# EAGLE design DC DC Converter Eagle (EAGLE 9.6.2)
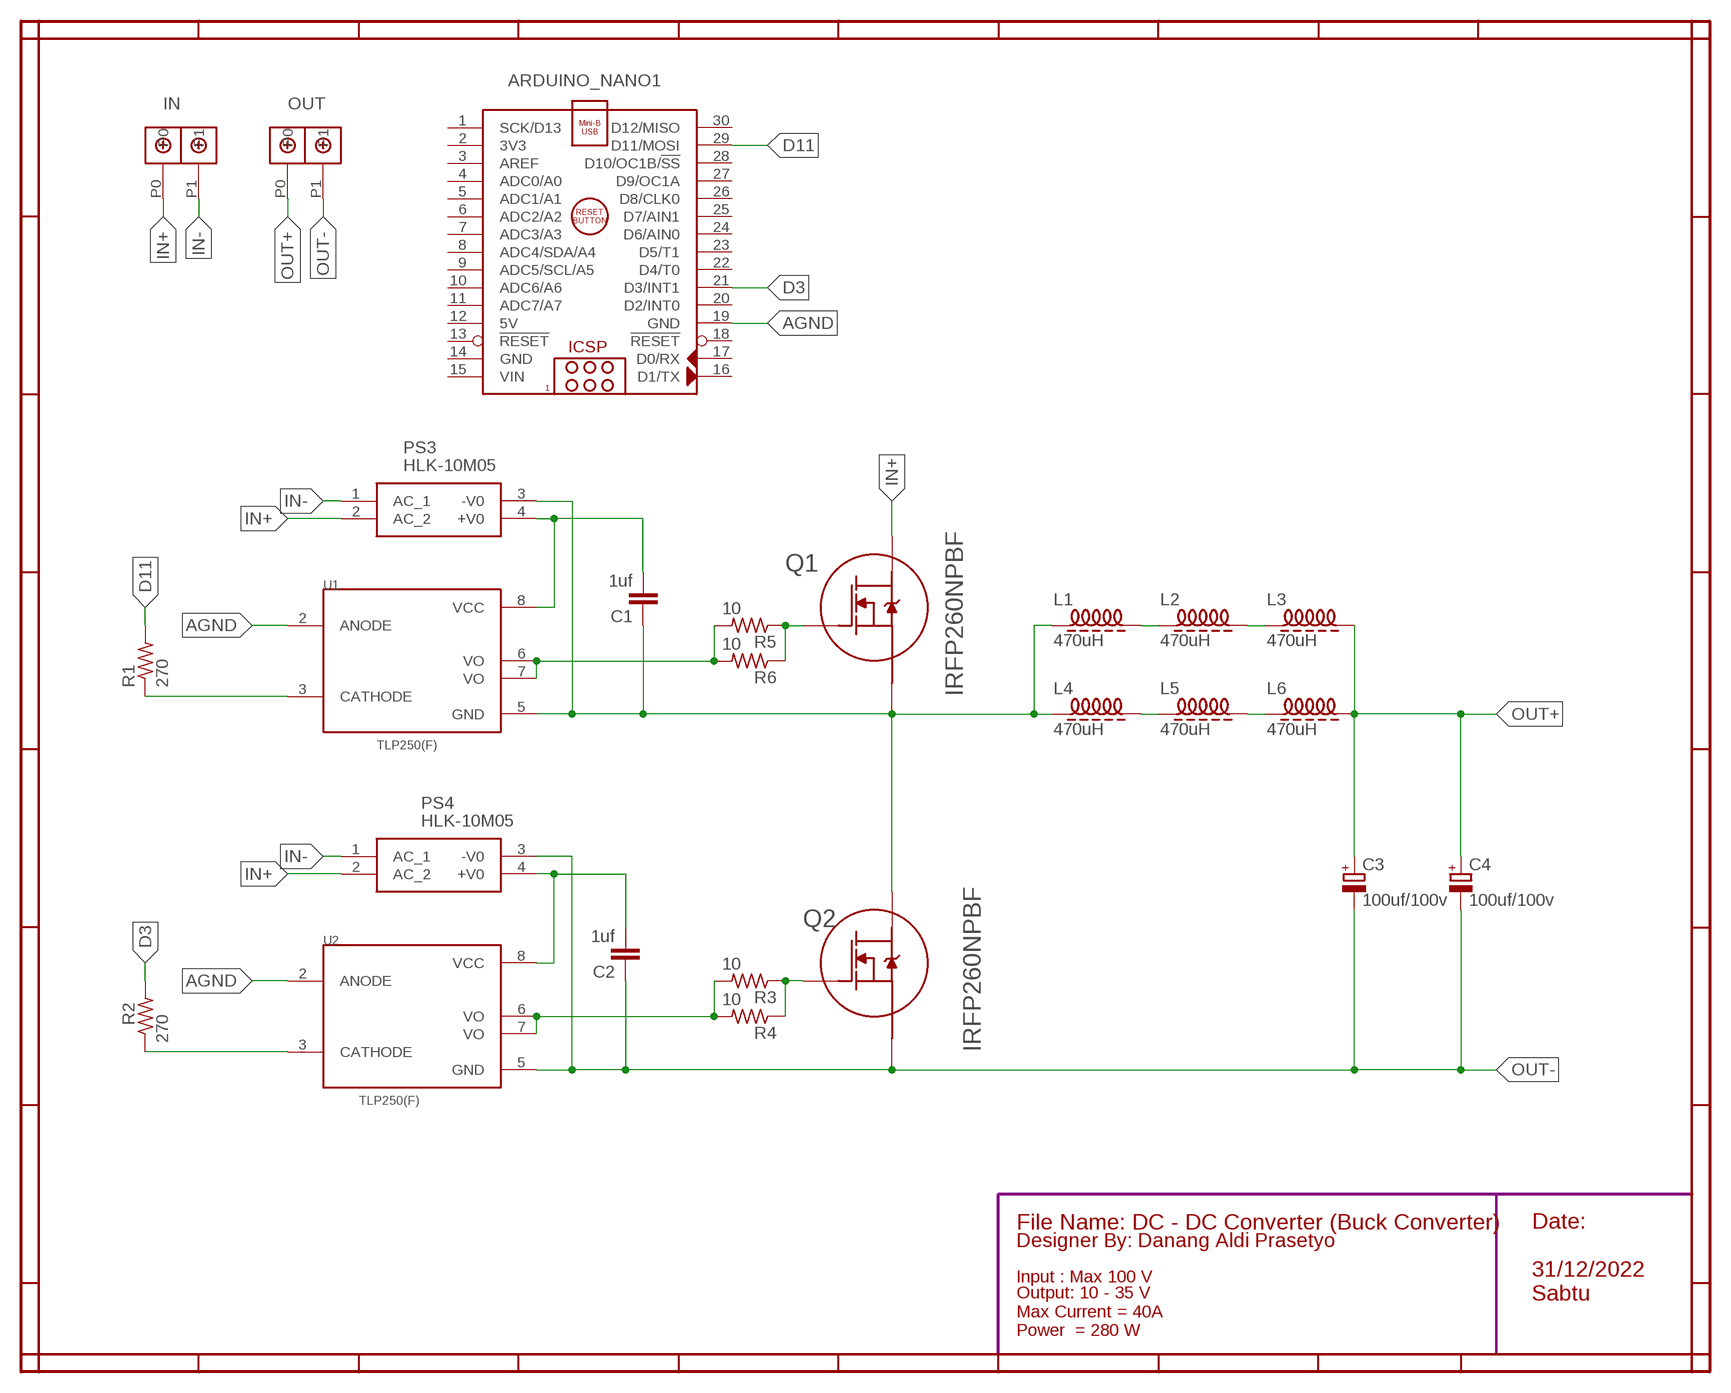
[diagram p0: schematic, sheet 1]

## Parts
ARDUINO_NANO1  ARDUINO_NANO  [ARDUINO_NANO]
C1  1uf  C-EU025-024X044  [C025-024X044]
C2  1uf  C-EU025-024X044  [C025-024X044]
C3  100uf/100v  CPOL-EUE5-10.5  [E5-10,5]
C4  100uf/100v  CPOL-EUE5-10.5  [E5-10,5]
L1  470uH  Z15/15CCW  [Z15/15]
L2  470uH  Z15/15CCW  [Z15/15]
L3  470uH  Z15/15CCW  [Z15/15]
L4  470uH  Z15/15CCW  [Z15/15]
L5  470uH  Z15/15CCW  [Z15/15]
L6  470uH  Z15/15CCW  [Z15/15]
PS3  HLK-10M05  [HLK10M05]
PS4  HLK-10M05  [HLK10M05]
Q1  IRFP260NPBF  [TO545P1590X530X2460-3]
Q2  IRFP260NPBF  [TO545P1590X530X2460-3]
R1  270  R-US_0207/7  [0207/7]
R2  270  R-US_0207/7  [0207/7]
R3  10  R-US_0207/7  [0207/7]
R4  10  R-US_0207/7  [0207/7]
R5  10  R-US_0207/7  [0207/7]
R6  10  R-US_0207/7  [0207/7]
U1  TLP250(F)  [DIP1016W50P254L966H380Q8P]
U2  TLP250(F)  [DIP1016W50P254L966H380Q8P]
U$1  DBCONN-1X2  [DBCONN-1X2]
U$2  DBCONN-1X2  [DBCONN-1X2]

## Nets
AGND: ARDUINO_NANO1.19(GND) U1.2(ANODE) U2.2(ANODE)
D3: ARDUINO_NANO1.21(D3/INT1) R2.2
D11: ARDUINO_NANO1.29(D11/MOSI) R1.2
IN+: PS3.2(AC_2) PS4.2(AC_2) Q1.2(D) U$1.P0
IN-: PS3.1(AC_1) PS4.1(AC_1) U$1.P1
N$1: C1.2 PS3.4(+V0) U1.8(VCC)
N$2: C1.1 L1.1 L4.1 PS3.3(-V0) Q1.3(S) Q2.2(D) U1.5(GND)
N$3: R1.1 U1.3(CATHODE)
N$4: Q1.1(G) R5.1 R6.1
N$6: R5.2 R6.2 U1.6(VO) U1.7(VO)
N$10: R2.1 U2.3(CATHODE)
N$12: C2.2 PS4.4(+V0) U2.8(VCC)
N$14: R3.2 R4.2 U2.6(VO) U2.7(VO)
N$15: Q2.1(G) R3.1 R4.1
N$16: L1.2 L2.1
N$17: L2.2 L3.1
N$18: L4.2 L5.1
N$19: L5.2 L6.1
OUT+: C3.+ C4.+ L3.2 L6.2 U$2.P0
OUT-: C2.1 C3.- C4.- PS4.3(-V0) Q2.3(S) U2.5(GND) U$2.P1
Unconnected: ARDUINO_NANO1.1(SCK/D13) ARDUINO_NANO1.2(3V3) ARDUINO_NANO1.3(AREF) ARDUINO_NANO1.4(ADC0/A0) ARDUINO_NANO1.5(ADC1/A1) ARDUINO_NANO1.6(ADC2/A2) ARDUINO_NANO1.7(ADC3/A3) ARDUINO_NANO1.8(ADC4/SDA/A4) ARDUINO_NANO1.9(ADC5/SCL/A5) ARDUINO_NANO1.10(ADC6/A6) ARDUINO_NANO1.11(ADC7/A7) ARDUINO_NANO1.13(!RESET) ARDUINO_NANO1.16(D1/TX) ARDUINO_NANO1.17(D0/RX) ARDUINO_NANO1.18(!RESET) ARDUINO_NANO1.20(D2/INT0) ARDUINO_NANO1.22(D4/T0) ARDUINO_NANO1.23(D5/T1) ARDUINO_NANO1.24(D6/AIN0) ARDUINO_NANO1.25(D7/AIN1) ARDUINO_NANO1.26(D8/CLK0) ARDUINO_NANO1.27(D9/OC1A) ARDUINO_NANO1.28(D10/OC1B/!SS) ARDUINO_NANO1.30(D12/MISO)

## Notes on the sheet
- IN | OUT
- File Name: DC - DC Converter (Buck Converter)
- Designer By: Danang Aldi Prasetyo
- Input : Max 100 V
- Date:
  
  31/12/2022
  Sabtu
- Output: 10 - 35 V
  Max Current = 40A
  Power  = 280 W

## Power pins joined to a net without a drawn wire
5V: ARDUINO_NANO1.12(5V)
GND: ARDUINO_NANO1.14(GND)
VIN: ARDUINO_NANO1.15(VIN)

## Library data of the parts
ARDUINO_NANO1 = ArduinoNanoV30:ARDUINO_NANO: Arduino Nano V3.0 Module Overview: The Arduino Nano is a small, complete, and breadboard-friendly board based on the ATmega328 (Arduino Nano 3.x) or ATmega168 (Arduino Nano 2.x). It has more or less the same functionality of the Arduino Duemilanove, but in a different package. It lacks only a DC power jack, and works with a Mini-B USB cable instead of a standard one. The Nano was designed and is being produced by Gravitech <http://www.gravitech.us/arna30wiatp.html>. General specifications: Item Value Microcontroller Atmel ATmega168 or ATmega328 Operating Voltage (logic level) 5 V Input Voltage (recommended) 7-12 V Input Voltage (limits) 6-20 V Digital I/O Pins 14 (of which 6 provide PWM output) Analog Input Pins 8 DC Current per I/O Pin 40 mA Flash Memory 16 KB (ATmega168) or 32 KB (ATmega328) of which 2 KB used by bootloader SRAM 1 KB (ATmega168) or 2 KB (ATmega328) EEPROM 512 bytes (ATmega168) or 1 KB (ATmega328) Clock Speed 16 MHz Dimensions (Inches) 0.73" x 1.70" Dimensions (mm) 18mm x 45mm Overall height About 9 mm (not including pins) Weigth 5 g Power: The Arduino Nano can be powered via the Mini-B USB connection, 6-20V unregulated external power supply (pin 30), or 5V regulated external power supply (pin 27). The power source is automatically selected to the highest voltage source. Memory: The ATmega168 has 16 KB of flash memory for storing code (of which 2 KB is used for the bootloader); the ATmega328 has 32 KB, (also with 2 KB used for the bootloader). The ATmega168 has 1 KB of SRAM and 512 bytes of EEPROM (which can be read and written with the EEPROM library); the ATmega328 has 2 KB of SRAM and 1 KB of EEPROM. Input and Output: Each of the 14 digital pins on the Nano can be used as an input or output, using pinMode(), digitalWrite(), and digitalRead() functions. They operate at 5 volts. Each pin can provide or receive a maximum of 40 mA and has an internal pull-up resistor (disconnected by default) of 20-50 kOhms. In addition, some pins have specialized functions. Visit Arduino - ArduinoBoardNano <https://www.arduino.cc/en/Main/ArduinoBoardNano>
C1 C2 = rcl:C-EU: CAPACITOR, European symbol; SPICEPREFIX: C
C3 C4 = rcl:CPOL-EU: POLARIZED CAPACITOR, European symbol; SPICEPREFIX: C
L1-L6 = inductor-neosid:Z?CCW: CHOKE free-suspension choke/nominal inductance winding counter clockwise; OC_FARNELL: unknown; OC_NEWARK: unknown
PS3 PS4 = HLK-10M05:HLK-10M05: HI-LINK HLK-10M05 Manufacturer : HI-LINK <https://lcsc.com//brand-detail/11515.html> Mfr.Part # HLK-10M05 LCSC Part # C403745 <https://lcsc.com/product-detail/show_C403745.html> Package : Through Hole Datasheet :  EasyEDA Model <javascript:void(0);> Power Module AC-DC Through Hole RoHS Source: Datasheet <https://datasheet.lcsc.com/szlcsc/1909111105_HI-LINK-HLK-10M05_C403745.pdf> Check availability <https://pricing.snapeda.com/parts/HLK-10M05/Hi-link/view-part?ref=eda>; AVAILABILITY: Not in stock; DESCRIPTION: 10W Ultra-Compact Power Module; MF: Hi-link; MP: HLK-10M05; PACKAGE: Package; PRICE: None
Q1 Q2 = IRFP260NPBF:IRFP260NPBF: Single N-Channel 200 V 0.04 Ohm 234 nC 300 W Flange Mount Mosfet - TO-247AC Check availability <https://pricing.snapeda.com/parts/IRFP260NPBF/Infineon%20Technologies/view-part?ref=eda>; AVAILABILITY: In Stock; DESCRIPTION: RoHS Compliant | Low RDS(on) | Industry-leading quality | Dynamic dv/dt Rating | Fast Switching | Fully Avalanche Rated | 175C Operating Temperature; MF: Infineon Technologies; MP: IRFP260NPBF; PACKAGE: TO-247 Infineon; PRICE: None; PURCHASE-URL: https://pricing.snapeda.com/search/part/IRFP260NPBF/?ref=eda
R1-R6 = rcl:R-US_: RESISTOR, American symbol; SPICEPREFIX: R
U1 U2 = TLP250_F_:TLP250(F): Optocoupler; THT; Out: IGBT driver; 2.5kV; DIP8; 1.5A Check availability <https://pricing.snapeda.com/parts/TLP250%28F%29/Toshiba/view-part?ref=eda>; AVAILABILITY: In Stock; DESCRIPTION: 1.5A Gate Driver Optical Coupling 2500Vrms 1 Channel 8-DIP; MF: Toshiba; MP: TLP250(F); PACKAGE: DIP-8 Toshiba; PRICE: None; PURCHASE-URL: https://pricing.snapeda.com/search/part/TLP250(F)/?ref=eda
U$1 U$2 = terminal block hijau:DBCONN-1X2

## Board
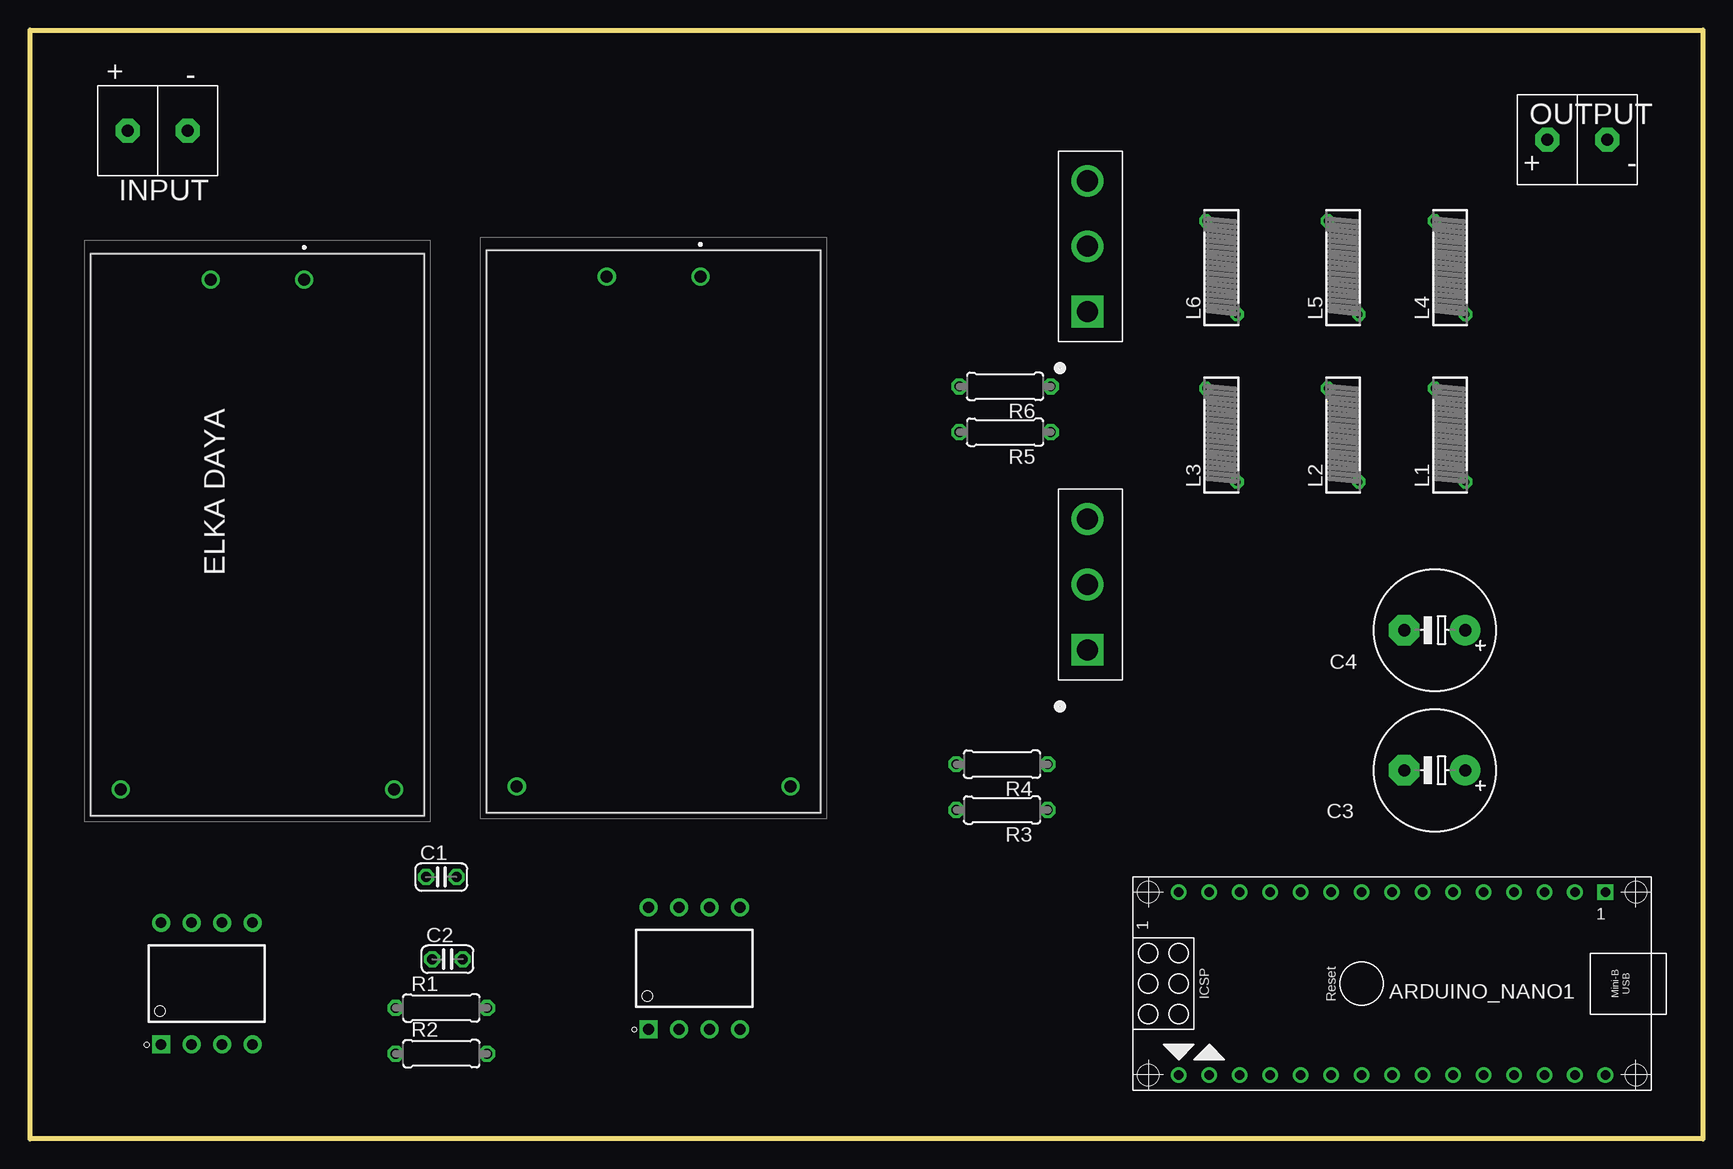
[diagram p1: board, top side]
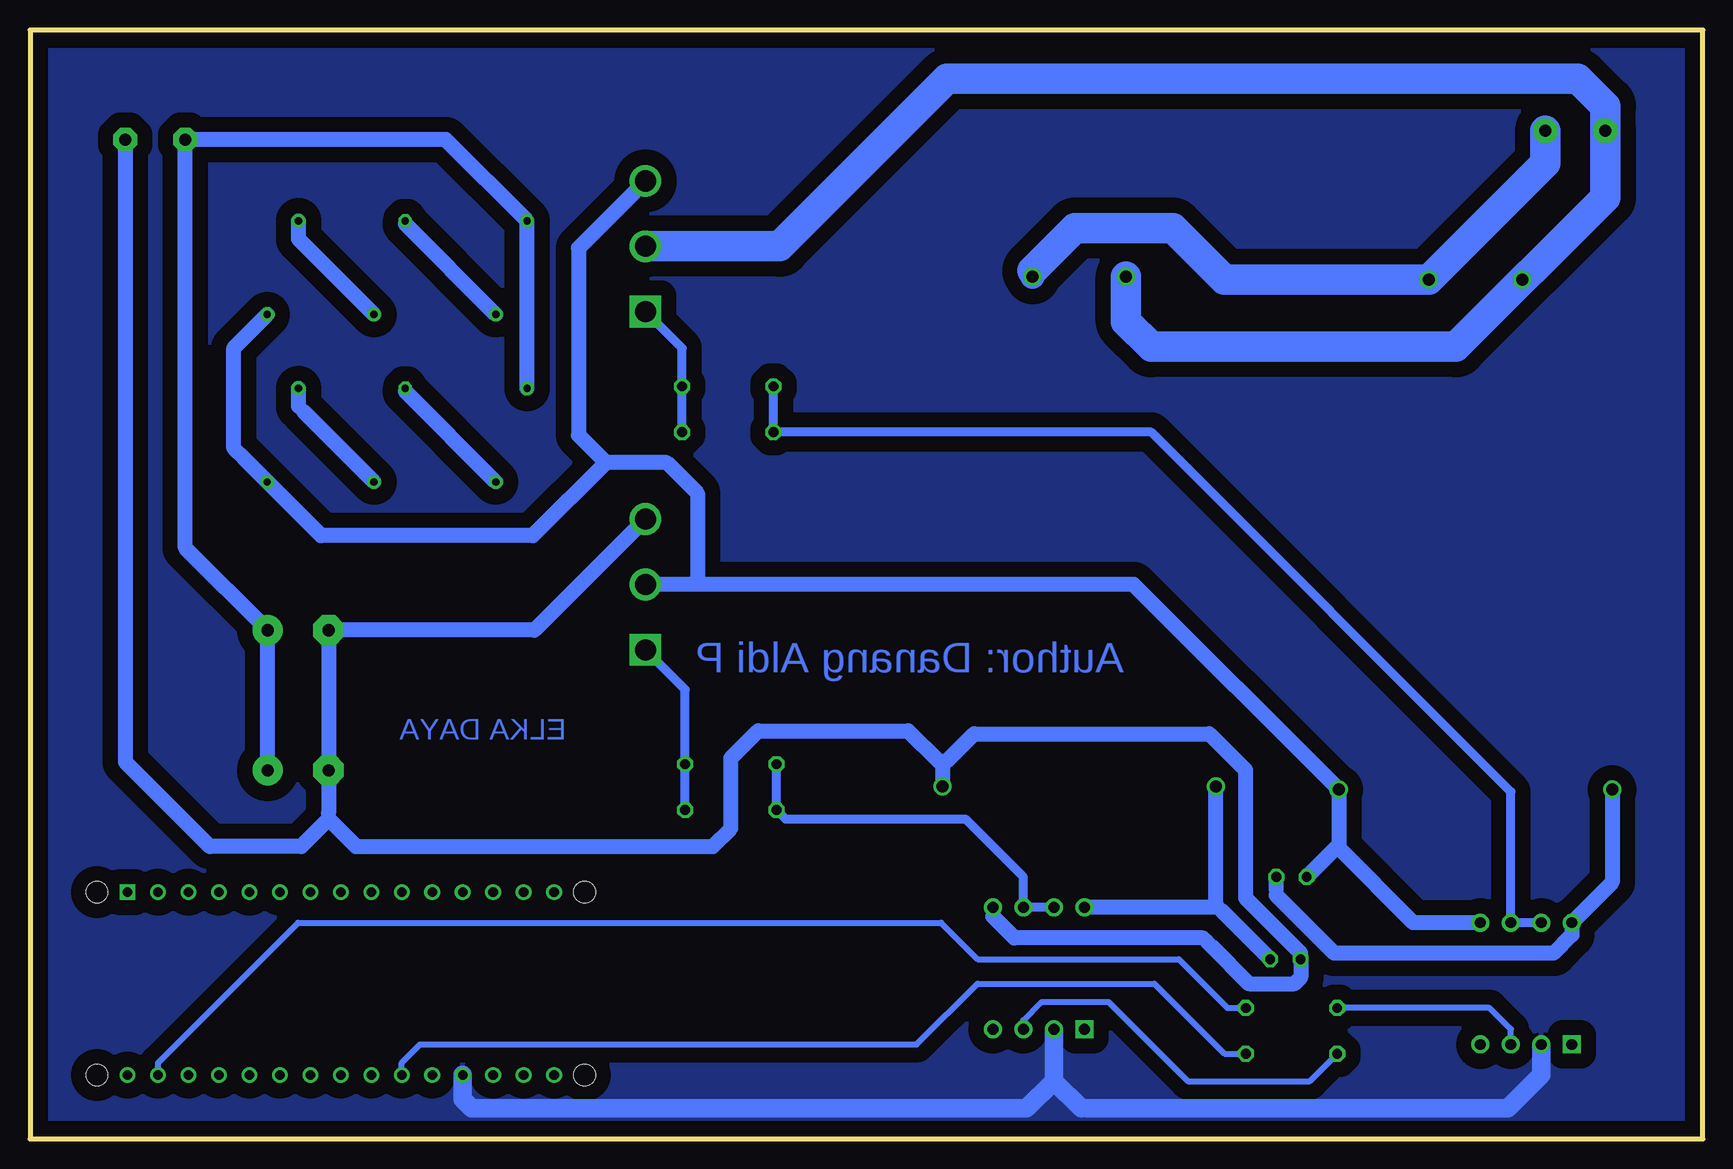
[diagram p2: board, bottom side, seen from below]

Size 139.45 x 92.46 mm. Coordinates in mm from the lower left corner, seen from the top.
Outline: 139.45,0 0,0 0,92.46 139.45,92.46 139.45,0
Copper layers (1*16): Top 0.035mm / dielectric 1.5mm / Bottom 0.035mm
Design rules "default": minimum track width 6mil, minimum drill 0.35mm, track to track 6mil, track to pad 6mil, pad to pad 6mil, via to via 6mil, smd to smd 6mil, copper to edge 40mil, drill to drill 6mil, minimum pad ring 10mil, minimum via ring 8mil, stop-mask expansion 4mil, vias tented up to drill 0mil, thermal gap 10mil

### Footprints (pad centres in the part's own frame; a part is rotated, then mirrored left to right if it is on the bottom)
ARDUINO_NANO = drill 0.8 square: 1 -20.32,-7.62 | drill 0.8: 2 -17.78,-7.62; 3 -15.24,-7.62; 4 -12.7,-7.62; 5 -10.16,-7.62; 6 -7.62,-7.62; 7 -5.08,-7.62; 8 -2.54,-7.62; 9 0,-7.62; 10 2.54,-7.62; 11 5.08,-7.62; 12 7.62,-7.62; 13 10.16,-7.62; 14 12.7,-7.62; 15 15.24,-7.62; 16 15.24,7.62; 17 12.7,7.62; 18 10.16,7.62; 19 7.62,7.62; 20 5.08,7.62; 21 2.54,7.62; 22 0,7.62; 23 -2.54,7.62; 24 -5.08,7.62; 25 -7.62,7.62; 26 -10.16,7.62; 27 -12.7,7.62; 28 -15.24,7.62; 29 -17.78,7.62; 30 -20.32,7.62 | hole 1.778: -22.86,-7.62; -22.86,7.62; 17.78,7.62; 17.78,-7.62
C025-024X044 = drill 0.813 octagon: 1 -1.27,0; 2 1.27,0
E5-10,5 = drill 1.016 pad 2.54: + -2.54,0 | drill 1.016 pad 2.54 octagon: - 2.54,0
Z15/15 = drill 0.6 octagon: 1 -3.9,-1.3; 2 3.9,1.3
HLK10M05 = drill 1 pad 1.5: 1 0,0; 2 0,-7.8; 3 42.5,7.5; 4 42.5,-15.3
TO545P1590X530X2460-3 = drill 1.76 pad 2.64 square: 1 -5.45,0.25 | drill 1.76 pad 2.64: 2 0,0.25; 3 5.45,0.25
0207/7 = drill 0.813 octagon: 1 -3.81,0; 2 3.81,0
DIP1016W50P254L966H380Q8P = drill 0.9 pad 1.5 square: 1 -5.08,3.81 | drill 0.9 pad 1.5: 2 -5.08,1.27; 3 -5.08,-1.27; 4 -5.08,-3.81; 5 5.08,-3.81; 6 5.08,-1.27; 7 5.08,1.27; 8 5.08,3.81
DBCONN-1X2 = drill 1 pad 2 octagon: P0 -2.54,0; P1 2.46,0

### Placement (x,y rotation side)
ARDUINO_NANO1  111,12.95 180 top
C1  34.29,21.84 0 top
C2  34.8,14.99 0 top
C3  117.09,30.73 180 top
C4  117.09,42.42 180 top
L1  118.36,58.67 90 top
L2  109.47,58.67 90 top
L3  99.31,58.67 90 top
L4  118.36,72.64 90 top
L5  109.47,72.64 90 top
L6  99.31,72.64 90 top
PS3  22.86,71.63 270 top
PS4  55.88,71.88 270 top
Q1  88.39,74.42 90 top
Q2  88.39,46.23 90 top
R1  34.29,10.92 0 top
R2  34.29,7.11 0 top
R3  81.03,27.43 180 top
R4  81.03,31.24 180 top
R5  81.28,58.93 180 top
R6  81.28,62.74 180 top
U1  14.73,12.95 90 top
U2  55.37,14.22 90 top
U$1  10.67,84.07 0 top
U$2  129.03,83.31 0 top

### Tracks (layer width: path | path; a pad name or v marks a point on that pad's centre or on a via)
AGND
  Bottom 1.27: 51.82,2.54 51.31,2.54
  Bottom 1.524: U1.2 13.46,5.33 16.26,2.54 51.31,2.54 | 51.82,2.54 54.1,4.83 | 54.1,4.83 U2.2 | 54.1,4.83 56.39,2.54 102.62,2.54 103.38,3.3 ARDUINO_NANO1.19
  pour Bottom (isolate 1.27): 0,92.46 139.45,92.46 139.45,0 0,0
D3
  Bottom 0.508: R2.2 39.88,7.11 45.72,12.95 60.45,12.95 65.53,7.87 106.93,7.87 108.46,6.35 ARDUINO_NANO1.21
D11
  Bottom 0.508: R1.2 39.62,10.92 43.69,14.99 60.45,14.99 63.5,18.03 117.09,18.03 128.78,6.35 ARDUINO_NANO1.29
IN+
  Bottom 2.032: 8.13,78.49 14.99,71.63 PS3.2 20.65,66.04 45.97,66.04
  Bottom 2.54: Q1.2 76.96,74.42 62.99,88.39 10.41,88.39 8.13,86.11 U$1.P0 8.13,78.49 20.57,66.04 45.97,66.04 48.08,68.15 PS4.2
IN-
  Bottom 2.032: U$1.P1 13.21,83.99 | 55.88,72.39 PS4.1
  Bottom 2.54: U$1.P1 13.13,81.36 PS3.1 39.88,71.63 44.2,75.95 52.32,75.95 55.88,72.39
N$1
  Bottom 0.762: 35.56,20.32 35.56,20.83
  Bottom 1.27: PS3.4 7.56,21.4 U1.8 10.92,17.02 12.45,15.49 30.73,15.49 35.56,20.32 | 35.56,20.83 C1.2
N$2
  Bottom 0.762: 83.82,46.23 49.02,46.23 | 83.82,46.23 Q2.2 | 121.6,56.71 L1.1 115.18,50.29 | 83.82,46.74 83.82,46.23
  Bottom 1.27: Q1.3 93.73,74.29 93.73,58.67 91.44,56.39 | 91.44,56.39 86.36,56.39 83.82,53.85 83.82,46.74 | 91.44,56.39 97.54,50.29 115.18,50.29 121.6,56.71 122.46,57.57 122.46,65.95 L4.1 | Q2.2 49.02,46.23 47.46,46.23 PS3.3 30.36,24.5 | U1.5 24.14,18.03 30.36,24.25 30.36,24.5 | C1.1 30.36,24.5
N$3
  Bottom 0.508: U1.3 16,9.14 17.78,10.92 R1.1
N$4
  Bottom 0.762: R5.1 R6.1 85.09,65.92 Q1.1
N$6
  Bottom 0.762: U1.7 U1.6 16,28.96 45.97,58.93 R5.2 R6.2
N$10
  Bottom 0.508: U2.3 56.64,9.91 55.12,11.43 49.53,11.43 42.93,4.83 32.77,4.83 R2.1
N$12
  Bottom 0.762: 40.13,19.05 40.39,19.3
  Bottom 1.27: C2.2 40.13,19.05 | PS4.4 40.58,19.5 40.39,19.3 U2.8
N$14
  Bottom 0.762: U2.7 U2.6 56.64,21.84 61.47,26.67 76.45,26.67 R3.2 R4.2
N$15
  Bottom 0.762: R3.1 R4.1 84.84,37.47 Q2.1
N$16
  Bottom 0.762: 116.65,60.65 117.06,61.06
  Bottom 1.27: L2.1 116.65,60.65 | 117.06,61.06 L1.2
N$17
  Bottom 0.762: 108.17,62.33 L2.2
  Bottom 1.27: L3.1 108.17,62.33
N$18
  Bottom 1.27: L4.2 117.06,75.03 L5.1
N$19
  Bottom 0.762: 108.17,76.3 L5.2
  Bottom 1.27: L6.1 108.17,76.3
OUT+
  Bottom 1.27: L3.2 L6.2 104.78,83.31 U$2.P0 126.49,49.28 C4.+ C3.+
OUT-
  Bottom 0.762: 41.02,16.13 41.28,16.38 | 63.38,31.16 60.76,33.78 | 114.55,27.18 114.55,26.67
  Bottom 1.27: 114.55,27.18 C3.- C4.- 97.4,42.42 Q2.3 | U$2.P1 131.49,31.42 124.46,24.38 116.84,24.38 114.55,26.67 112.27,24.38 82.55,24.38 81.03,25.91 81.03,31.75 78.74,34.04 66.26,34.04 63.74,31.52 | 63.74,31.52 63.38,31.16 PS4.3 | 63.74,31.52 63.03,31.52 60.76,33.78 41.15,33.78 38.1,30.73 38.1,20.07 33.53,15.49 C2.1 33.53,13.46 34.04,12.95 37.85,12.95 41.02,16.13 | 41.28,16.38 41.66,16.76 57.4,16.76 59.18,18.54 U2.5

### Text on the board
Bottom: Author: Danang Aldi P | ELKA DAYA
tNames: + | - | OUTPUT | + | - | INPUT | ELKA DAYA